# Altium schematic sheet 4110_4071_MP.SchDoc
size A4; SheetNumber: 1; SheetTotal: 1
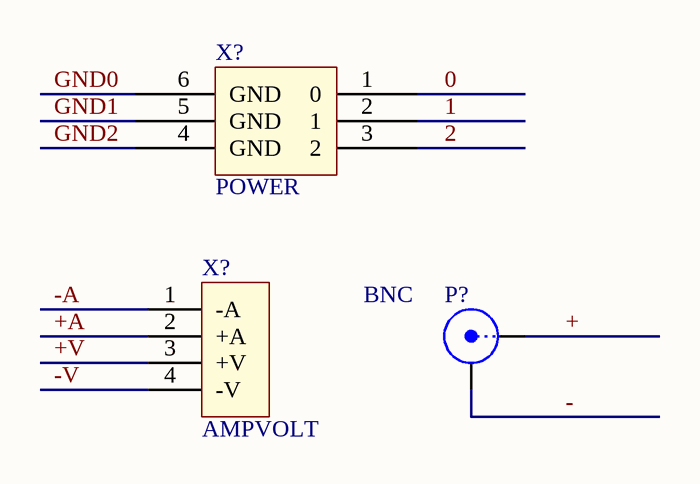
[diagram p0: 4110_4071_MP.SchDoc]

## Parts
(Parts that share a designator on the sheet are numbered #1, #2 ... from top to bottom, then left to right.)
P?  BNC  [BNC_RA CON]
X?#1  POWER  [POWER]
X?#2  AMPVOLT  [AMP_VOLTMETER]

## Nets
0: X?#1.1(0)
1: X?#1.2(1)
2: X?#1.3(2)
+: P?.1(X)
+A: X?#2.2(+A)
+V: X?#2.3(+V)
-: P?.2(Y)
-A: X?#2.1(-A)
-V: X?#2.4(-V)
GND0: X?#1.6(GND)
GND1: X?#1.5(GND)
GND2: X?#1.4(GND)

## Library data of the parts
P? = BNC: BNC Elbow Connector; LatestRevisionDate: 17-Jul-2002; LatestRevisionNote: Re-released for DXP Platform.; Publisher: Altium Limited
X?#2 = AMP_VOLTMETER